# Altium schematic sheet LowerPlumbingBayBoardSchematic.SchDoc
size A3; SheetNumber: 1; SheetTotal: 1
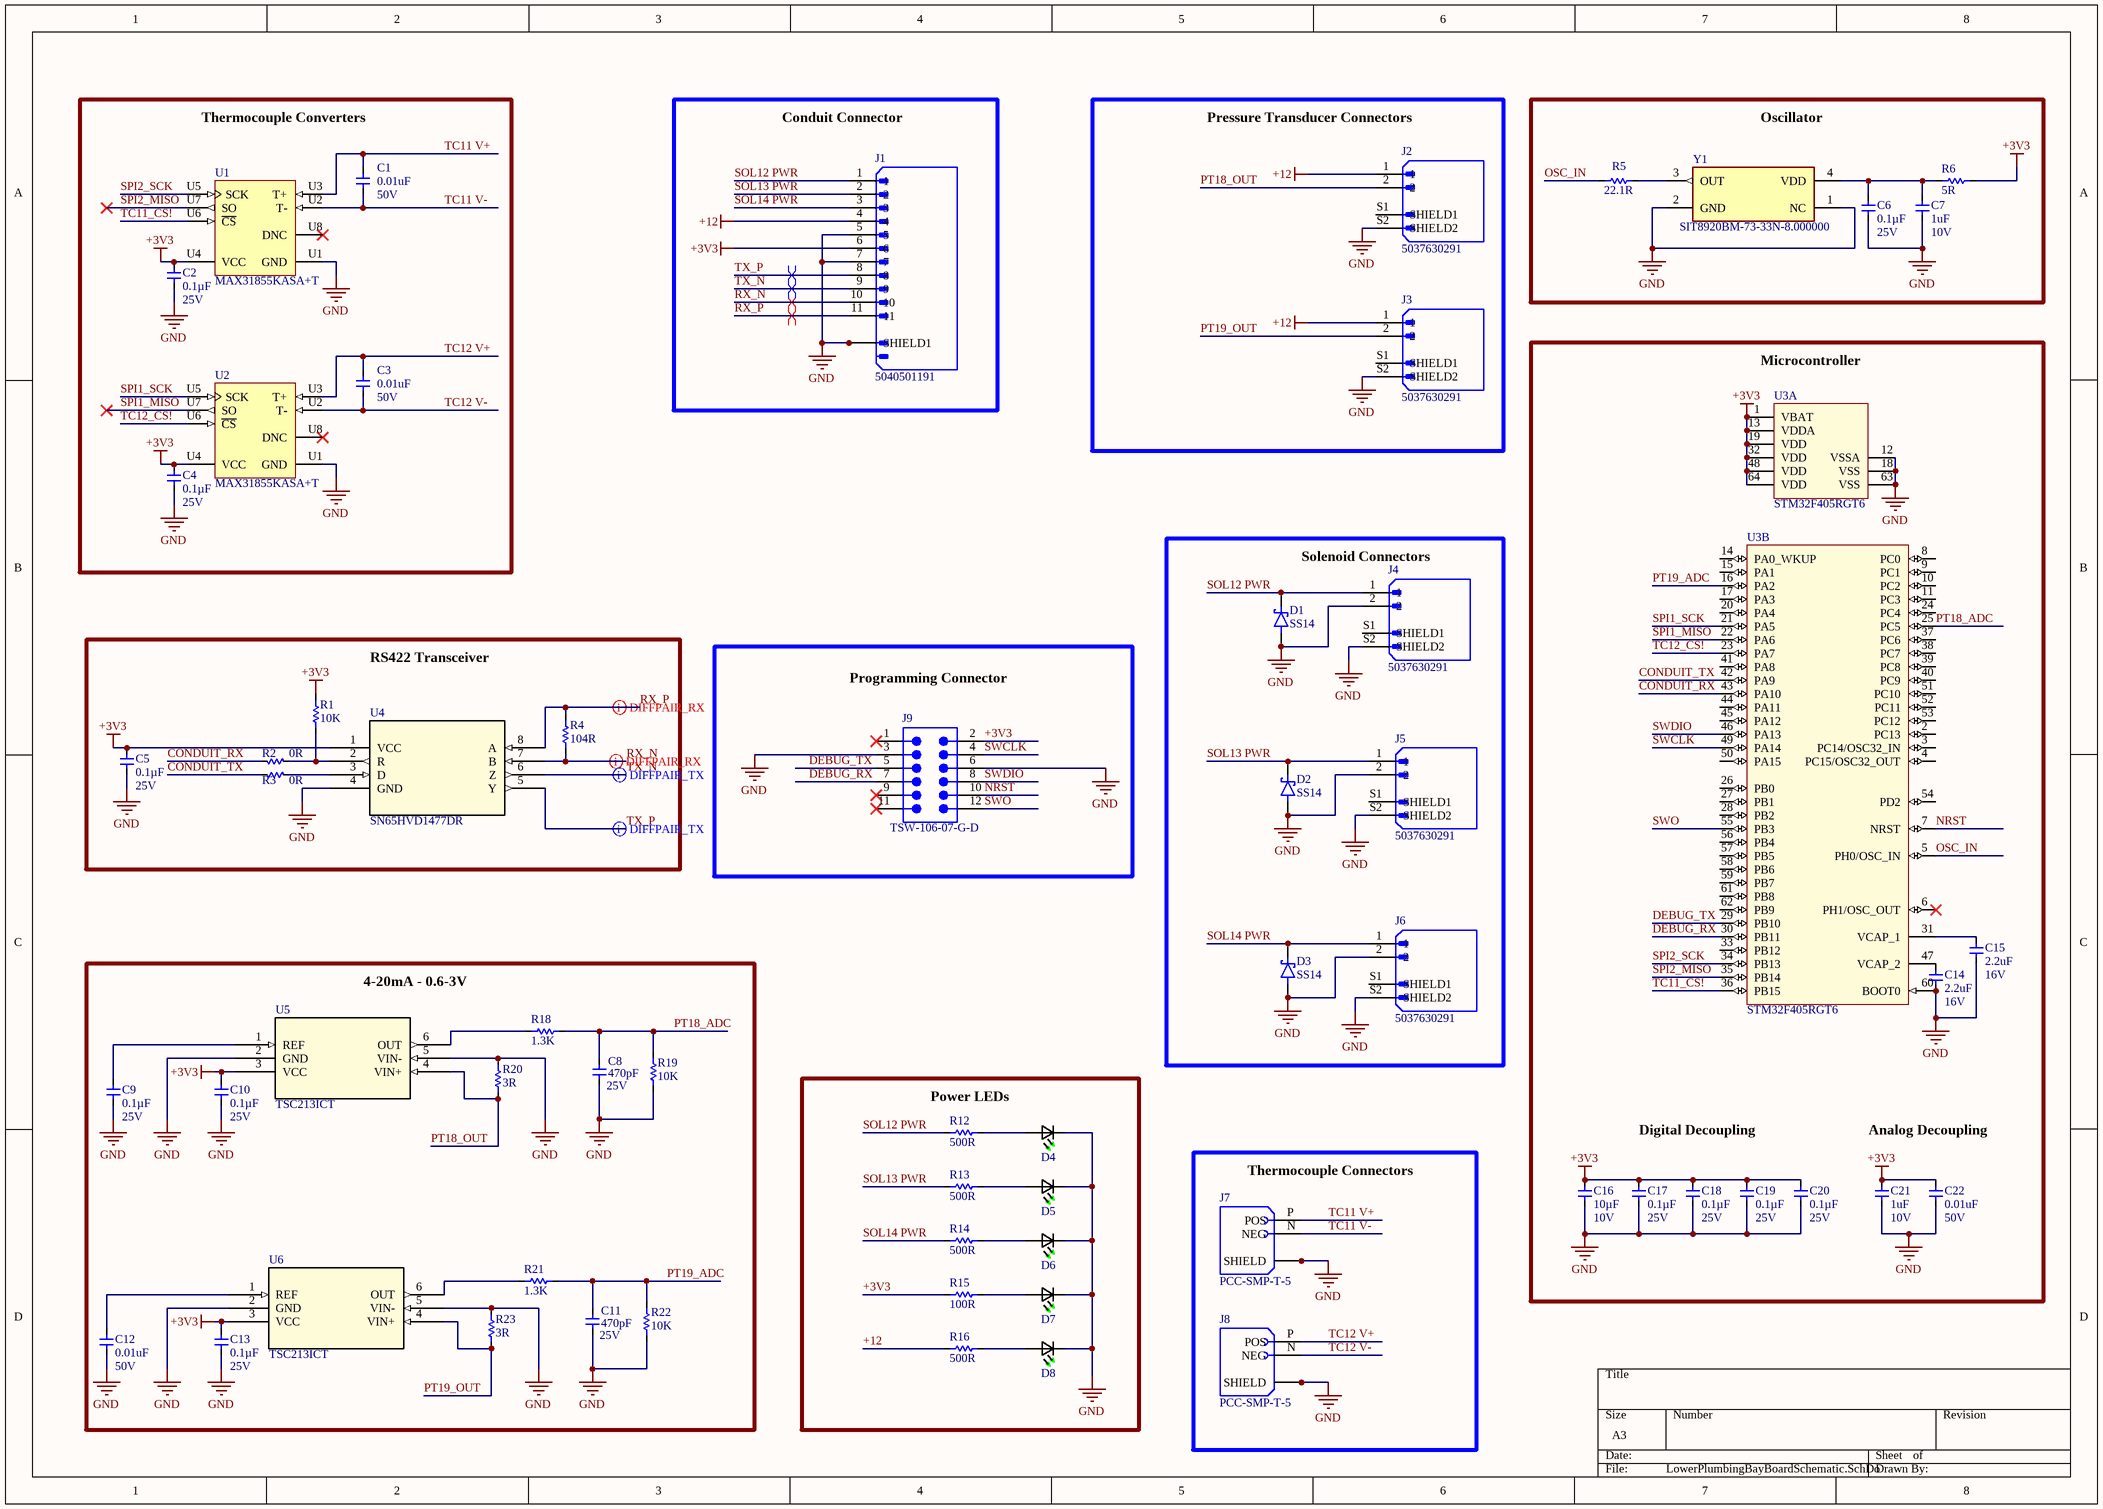
[diagram p0: LowerPlumbingBayBoardSchematic.SchDoc]

## Parts
C1  Capacitance: 0.01uF  Voltage - Rated: 50V  [0603]  (hidden comment: 06035A103JAT2A)
C2  Capacitance: 0.1µF  Voltage - Rated: 25V  [0603]  (hidden comment: CGA3E2X7R1E104K080AA)
C3  Capacitance: 0.01uF  Voltage - Rated: 50V  [0603]  (hidden comment: 06035A103JAT2A)
C4  Capacitance: 0.1µF  Voltage - Rated: 25V  [0603]  (hidden comment: CGA3E2X7R1E104K080AA)
C5  Capacitance: 0.1µF  Voltage - Rated: 25V  [0603]  (hidden comment: CGA3E2X7R1E104K080AA)
C6  Capacitance: 0.1µF  Voltage - Rated: 25V  [0603]  (hidden comment: CGA3E2X7R1E104K080AA)
C7  Capacitance: 1uF  Voltage - Rated: 10V  [0603]  (hidden comment: CL10A105KP8NNNC)
C8  Capacitance: 470pF  Voltage - Rated: 25V  [0603]  (hidden comment: 06031C471JAZ2A)
C9  Capacitance: 0.1µF  Voltage - Rated: 25V  [0603]  (hidden comment: 06035A103JAT2A)
C10  Capacitance: 0.1µF  Voltage - Rated: 25V  [0603]  (hidden comment: CGA3E2X7R1E104K080AA)
C11  Capacitance: 470pF  Voltage - Rated: 25V  [0603]  (hidden comment: 06031C471JAZ2A)
C12  Capacitance: 0.01uF  Voltage - Rated: 50V  [0603]  (hidden comment: 06035A103JAT2A)
C13  Capacitance: 0.1µF  Voltage - Rated: 25V  [0603]  (hidden comment: CGA3E2X7R1E104K080AA)
C14  Capacitance: 2.2uF  Voltage - Rated: 16V  [0603]  (hidden comment: C1608X5R1C225K080AB)
C15  Capacitance: 2.2uF  Voltage - Rated: 16V  [0603]  (hidden comment: C1608X5R1C225K080AB)
C16  Capacitance: 10µF  Voltage - Rated: 10V  [0603]  (hidden comment: CGA3EDX7T1A106M080AU)
C17  Capacitance: 0.1µF  Voltage - Rated: 25V  [0603]  (hidden comment: CGA3E2X7R1E104K080AA)
C18  Capacitance: 0.1µF  Voltage - Rated: 25V  [0603]  (hidden comment: CGA3E2X7R1E104K080AA)
C19  Capacitance: 0.1µF  Voltage - Rated: 25V  [0603]  (hidden comment: CGA3E2X7R1E104K080AA)
C20  Capacitance: 0.1µF  Voltage - Rated: 25V  [0603]  (hidden comment: CGA3E2X7R1E104K080AA)
C21  Capacitance: 1uF  Voltage - Rated: 10V  [0603]  (hidden comment: CL10A105KP8NNNC)
C22  Capacitance: 0.01uF  Voltage - Rated: 50V  [0603]  (hidden comment: 06035A103JAT2A)
D1  SS14  [DIOM4325X250N]
D2  SS14  [DIOM4325X250N]
D3  SS14  [DIOM4325X250N]
D4  LTST-C191KGKT  [LTST-C191KGKT]  (value not drawn)
D5  LTST-C191KGKT  [LTST-C191KGKT]  (value not drawn)
D6  LTST-C191KGKT  [LTST-C191KGKT]  (value not drawn)
D7  LTST-C191KGKT  [LTST-C191KGKT]  (value not drawn)
D8  LTST-C191KGKT  [LTST-C191KGKT]  (value not drawn)
J1  5040501191  [MOLEX_5040501191]
J2  5037630291  [2MOLEX_5037630291]
J3  5037630291  [2MOLEX_5037630291]
J4  5037630291  [2MOLEX_5037630291]
J5  5037630291  [2MOLEX_5037630291]
J6  5037630291  [2MOLEX_5037630291]
J7  PCC-SMP-T-5  [OMEGA_PCC-SMP-K-5]
J8  PCC-SMP-T-5  [OMEGA_PCC-SMP-K-5]
J9  TSW-106-07-G-D  [SMTC-TSW-106-07-X-D]
R1  Resistance: 10K  [0603]  (hidden comment: ERJ-3GEYJ103V)
R2  value 0R  [0603]  (hidden comment: RC0603JR-070RL)
R3  value 0R  [0603]  (hidden comment: RC0603JR-070RL)
R4  Resistance: 104R  [0603]  (hidden comment: RN73H1JTTD1040D25)
R5  Resistance: 22.1R  [0603]  (hidden comment: ERJ-P03F22R1V)
R6  Resistance: 5R  [BO_PWR2010]  (hidden comment: PWR2010W5R00JE)
R12  Resistance: 500R  [0603]  (hidden comment: RT0603BRC07500RL)
R13  Resistance: 500R  [0603]  (hidden comment: RT0603BRC07500RL)
R14  Resistance: 500R  [0603]  (hidden comment: RT0603BRC07500RL)
R15  Resistance: 100R  [0603]  (hidden comment: ERJ-P03F1000V)
R16  Resistance: 500R  [0603]  (hidden comment: RT0603BRC07500RL)
R18  Resistance: 1.3K  [0603]  (hidden comment: ERJ-H3EF1301V)
R19  Resistance: 10K  [0603]  (hidden comment: ERJ-3GEYJ103V)
R20  Resistance: 3R  [0603]  (hidden comment: ERJ-3RQF3R0V)
R21  Resistance: 1.3K  [0603]  (hidden comment: ERJ-H3EF1301V)
R22  Resistance: 10K  [0603]  (hidden comment: ERJ-3GEYJ103V)
R23  Resistance: 3R  [0603]  (hidden comment: ERJ-3RQF3R0V)
U1  MAX31855KASA+T  [MAXM-S8+4_L]
U2  MAX31855KASA+T  [MAXM-S8+4_L]
U3  STM32F405RGT6  [STM-LQFP64_L]  (parts A,B of 2)
U4  SN65HVD1477DR  [D8_TEX]
U5  TSC213ICT  [SC70-6_STM]
U6  TSC213ICT  [SC70-6_STM]
Y1  SIT8920BM-73-33N-8.000000  [FP-SIT8920BM-73-33N-8_000-MFG]

## Blocks framed on the sheet
Thermocouple Converters: C1-C4 U1 U2
Conduit Connector: J1
Pressure Transducer Connectors: J2 J3
Oscillator: C6 C7 R5 R6 Y1
Solenoid Connectors: D1-D3 J4-J6
RS422 Transceiver: C5 R1-R4 U4
Programming Connector: J9
4-20mA - 0.6-3V: C8-C13 R18-R23 U5 U6
Power LEDs: D4-D8 R12-R16
Thermocouple Connectors: J7 J8

## Nets
+3V3: C2.1 C4.1 C5.1 C10.1 C13.1 C16.1 C17.1 C18.1 C19.1 C20.1 C21.1 C22.1 J1.6 J9.2 R1.2 R6.2 R15.1 U1.U4(VCC) U2.U4(VCC) U3.1(VBAT) U3.13(VDDA) U3.19(VDD) U3.32(VDD) U3.48(VDD) U3.64(VDD) U4.1(VCC) U5.3(VCC) U6.3(VCC)
+12: J1.4 J2.1 J3.1 R16.1
GND: C2.2 C4.2 C5.2 C6.1 C7.1 C8.2 C9.2 C10.2 C11.2 C12.2 C13.2 C14.2 C15.1 C16.2 C17.2 C18.2 C19.2 C20.2 C21.2 C22.2 D1.A D2.A D3.A D4.1(K2) D5.1(K2) D6.1(K2) D7.1(K2) D8.1(K2) J1.5 J1.7 J1.S1(SHIELD1) J1.S2(SHIELD1) J2.S2(SHIELD2) J3.S2(SHIELD2) J4.2 J4.S2(SHIELD2) J5.2 J5.S2(SHIELD2) J6.2 J6.S2(SHIELD2) J7.S1(SHIELD) J7.S2(SHIELD) J8.S1(SHIELD) J8.S2(SHIELD) J9.3 J9.6 R19.1 R20.2 R22.1 R23.2 U1.U1(GND) U2.U1(GND) U3.12(VSSA) U3.18(VSS) U3.60(BOOT0) U3.63(VSS) U4.4(GND) U5.2(GND) U5.5(VIN-) U6.2(GND) U6.5(VIN-) Y1.1(NC) Y1.2(GND)
CONDUIT_RX: R2.1 U3.43(PA10)
CONDUIT_TX: R3.1 U3.42(PA9)
DEBUG_RX: J9.7 U3.30(PB11)
DEBUG_TX: J9.5 U3.29(PB10)
NRST: J9.10 U3.7(NRST)
OSC_IN: R5.1 U3.5(PH0/OSC_IN)
PT18_ADC: C8.1 R18.2 R19.2 U3.25(PC5)
PT18_OUT: J2.2 R20.1 U5.4(VIN+)
PT19_ADC: C11.1 R21.2 R22.2 U3.16(PA2)
PT19_OUT: J3.2 R23.1 U6.4(VIN+)
RX_N: J1.10 R4.1 U4.7(B)
RX_P: J1.11 R4.2 U4.8(A)
SOL12 PWR: D1.C(K) J1.1 J4.1 R12.1
SOL13 PWR: D2.C(K) J1.2 J5.1 R13.1
SOL14 PWR: D3.C(K) J1.3 J6.1 R14.1
SPI1_MISO: U2.U7(SO) U3.22(PA6)
SPI1_SCK: U2.U5(SCK) U3.21(PA5)
SPI2_MISO: U1.U7(SO) U3.35(PB14)
SPI2_SCK: U1.U5(SCK) U3.34(PB13)
SWCLK: J9.4 U3.49(PA14)
SWDIO: J9.8 U3.46(PA13)
SWO: J9.12 U3.55(PB3)
TC11 V+: C1.1 J7.P(POS) U1.U3(T+)
TC11 V-: C1.2 J7.N(NEG) U1.U2(T-)
TC11_CS!: U1.U6(~{CS}) U3.36(PB15)
TC12 V+: C3.1 J8.P(POS) U2.U3(T+)
TC12 V-: C3.2 J8.N(NEG) U2.U2(T-)
TC12_CS!: U2.U6(~{CS}) U3.23(PA7)
TX_N: J1.9 U4.6(Z)
TX_P: J1.8 U4.5(Y)
NetC6_2: C6.2 C7.2 R6.1 Y1.4(VDD)
NetC9_1: C9.1 U5.1(REF)
NetC12_1: C12.1 U6.1(REF)
NetC14_1: C14.1 U3.47(VCAP_2)
NetC15_2: C15.2 U3.31(VCAP_1)
NetD4_2: D4.2(A2) R12.2
NetD5_2: D5.2(A2) R13.2
NetD6_2: D6.2(A2) R14.2
NetD7_2: D7.2(A2) R15.2
NetD8_2: D8.2(A2) R16.2
NetR1_1: R1.1 R2.2 U4.2(R)
NetR3_2: R3.2 U4.3(D)
NetR5_2: R5.2 Y1.3(OUT)
NetR18_1: R18.1 U5.6(OUT)
NetR21_1: R21.1 U6.6(OUT)

Not connected (* = marked no-connect by the designer): J2 S1(SHIELD1); J3 S1(SHIELD1); J4 S1(SHIELD1); J5 S1(SHIELD1); J6 S1(SHIELD1); J9 1* 9* 11*; U1 U8(DNC)*; U2 U8(DNC)*; U3 2(PC13) 3(PC14/OSC32_IN) 4(PC15/OSC32_OUT) 6(PH1/OSC_OUT)* 8(PC0) 9(PC1) 10(PC2) 11(PC3) 14(PA0_WKUP) 15(PA1) 17(PA3) 20(PA4) 24(PC4) 26(PB0) 27(PB1) 28(PB2) 33(PB12) 37(PC6) 38(PC7) 39(PC8) 40(PC9) 41(PA8) 44(PA11) 45(PA12) 50(PA15) 51(PC10) 52(PC11) 53(PC12) 54(PD2) 56(PB4) 57(PB5) 58(PB6) 59(PB7) 61(PB8) 62(PB9)

## Layout directives
differential pair: RX_N, RX_P, TX_N, TX_P

## Notes on the sheet
- (near U3) Microcontroller
- Digital Decoupling
- Analog Decoupling

## Library data of the parts
C1 C3 C22 = CGA3E2X7R1H103K080AA: Multilayer Ceramic Capacitors MLCC - SMD/SMT .01UF 50V 5% 0603; Manufacturer: TDK Corporation; Tolerance: ±10%; Temperature Coefficient: X7R; Operating Temperature: -55°C ~ 125°C; Mounting Type: Surface Mount, MLCC; Package / Case: 0603 (1608 Metric); Size / Dimension: 0.063" L x 0.031" W (1.60mm x 0.80mm); Manufacturer Part Number: CGA3E2X7R1H103K080AA; Thickness (Max): 0.035" (0.90mm)
  C3 C22: ComponentLink1Description: Datasheet; ComponentLink1URL: https://product.tdk.com/info/en/catalog/spec/mlccspec_automotive_general_en.pdf; Supplier 1: Digi-Key; Supplier Part Number 1: 445-5662-1-ND
C2 C4-C6 C10 C13 C17-C20 = CGA3E2X7R1E104K080AA: CAP CER 0.1UF 25V X7R 0603; Manufacturer: TDK Corporation; Tolerance: ±10%; Temperature Coefficient: X7R; Operating Temperature: -55°C ~ 125°C; Mounting Type: Surface Mount, MLCC; Package / Case: 0603 (1608 Metric); Size / Dimension: 0.063" L x 0.031" W (1.60mm x 0.80mm); Manufacturer Part Number: CGA3E2X7R1E104K080AA; Thickness (Max): 0.035" (0.90mm); ComponentLink1Description: Datasheet; ComponentLink1URL: https://product.tdk.com/info/en/catalog/spec/mlccspec_automotive_general_en.pdf; Supplier 1: Digi-Key; Supplier Part Number 1: 445-5667-1-ND
C7 C21 = CL10A105KP8NNNC: CAP CER 1UF 10V X5R 0603; Manufacturer: Samsung Electro-Mechanics; Tolerance: ±10%; Temperature Coefficient: X5R; Operating Temperature: -55°C ~ 85°C; Mounting Type: Surface Mount, MLCC; Package / Case: 0603 (1608 Metric); Size / Dimension: 0.063" L x 0.031" W (1.60mm x 0.80mm); Manufacturer Part Number: CL10A105KP8NNNC; Thickness (Max): 0.035" (0.90mm); ComponentLink1Description: Datasheet; ComponentLink1URL: http://www.samsungsem.com/kr/support/product-search/mlcc/__icsFiles/afieldfile/2019/05/10/19-CL10A105KP8NNNC.pdf; Supplier 1: Digi-Key; Supplier Part Number 1: 1276-1182-1-ND
C8 C11 = CGA3E2X7R1E104K080AA: Multilayer Ceramic Capacitors MLCC - SMD/SMT 100V 470pF X7R 0603 5% Flex Soft; Manufacturer: TDK Corporation; Tolerance: ±10%; Temperature Coefficient: X7R; Operating Temperature: -55°C ~ 125°C; Mounting Type: Surface Mount, MLCC; Package / Case: 0603 (1608 Metric); Size / Dimension: 0.063" L x 0.031" W (1.60mm x 0.80mm); Manufacturer Part Number: CGA3E2X7R1E104K080AA; Thickness (Max): 0.035" (0.90mm); ComponentLink1Description: Datasheet; ComponentLink1URL: https://product.tdk.com/info/en/catalog/spec/mlccspec_automotive_general_en.pdf; Supplier 1: Digi-Key; Supplier Part Number 1: 445-5667-1-ND
C9 C12 = CGA3E2X7R1E104K080AA: Multilayer Ceramic Capacitors MLCC - SMD/SMT .01UF 50V 5% 0603; Manufacturer: TDK Corporation; Tolerance: ±10%; Temperature Coefficient: X7R; Operating Temperature: -55°C ~ 125°C; Mounting Type: Surface Mount, MLCC; Package / Case: 0603 (1608 Metric); Size / Dimension: 0.063" L x 0.031" W (1.60mm x 0.80mm); Manufacturer Part Number: CGA3E2X7R1E104K080AA; Thickness (Max): 0.035" (0.90mm); ComponentLink1Description: Datasheet; ComponentLink1URL: https://product.tdk.com/info/en/catalog/spec/mlccspec_automotive_general_en.pdf; Supplier 1: Digi-Key; Supplier Part Number 1: 445-5667-1-ND
C14 C15 = C1608X5R1C225K080AB: CAP CER 2.2UF 16V X5R 0603; Manufacturer: TDK Corporation; Tolerance: ±10%; Temperature Coefficient: X5R; Operating Temperature: -55°C ~ 85°C; Mounting Type: Surface Mount, MLCC; Package / Case: 0603 (1608 Metric); Size / Dimension: 0.063" L x 0.031" W (1.60mm x 0.80mm); Manufacturer Part Number: C1608X5R1C225K080AB; Thickness (Max): 0.035" (0.90mm); ComponentLink1Description: Datasheet; ComponentLink1URL: https://product.tdk.com/info/en/catalog/spec/mlccspec_commercial_general_midvoltage_en.pdf; Supplier 1: Digi-Key; Supplier Part Number 1: 445-5157-1-ND
C16 = CL10A106MP8NNNC: Multilayer Ceramic Capacitors MLCC - SMD/SMT 0603,X7T,10V,10uF,+/-20%,0.8mm, AEC-Q200; Manufacturer: Samsung Electro-Mechanics; Tolerance: ±20%; Temperature Coefficient: X5R; Operating Temperature: -55°C ~ 85°C; Mounting Type: Surface Mount, MLCC; Package / Case: 0603 (1608 Metric); Size / Dimension: 0.063" L x 0.031" W (1.60mm x 0.80mm); Manufacturer Part Number: CL10A106MP8NNNC; Thickness (Max): 0.035" (0.90mm); ComponentLink1Description: Datasheet; ComponentLink1URL: https://static6.arrow.com/aropdfconversion/f91a1722e2705c3d73cfb1979021b64ae4055093/19-cl10a106mp8nnnc.pdf; Supplier 1: Digi-Key; Supplier Part Number 1: 1276-1871-1-ND
D1-D3 = SS14: Schottky Diodes & Rectifiers SMA 40V 1.0A; Value: *; Availability: Unavailable; Price: None; Package: None; MP: SS14
D4-D8 = LTST-C191KGKT: LED,  LTST-C191KGKT; Manufacturer: Vishay Lite-On; Color: Green; Lens Color: Colorless; Luminous Intensity: 35mcd; Viewing Angle: 130°; Forward Voltage: 2V; Dominant Wavelength: 571nm; Test Current: 20mA; Lens Transparency: Clear; Wavelength: 574nm; Lens Style: Flat,Rectangular,Colorless; Number of LEDs: 1; Max Power Dissipation: 75mW; Lens Size: 0.8mm; Supplier 1: Arrow Electronics; Supplier Part Number 1: LTST-C191KGKT; Manufacturer Part Number: LTST-C191KGKT; RoHS: Yes; Category: Uncategorized; Stock: 3111; Pricing: 1=0.223, 10=0.1424, 25=0.1365, 100=0.0663, 250=0.0656, 500=0.0612, 1000=0.0451, 2000=0.0464, 3000=0.0448, 5000=0.0403, 10000=0.0363, 25000=0.0323, 50000=0.0316 (USD); Mount: Surface Mount; Case/Package: 0603; Number of Pins: 2; Case Code (Metric): 1608; Case Code (Imperial): 0603; Min Operating Temperature: -55°C; Max Operating Temperature: 85°C; Packaging: Tape and Reel; Series: -; Length: 1.6mm; Width: 0.8mm; Height: 0.65mm; RoHS Compliant: Yes; Lead Free: Lead Free; ComponentLink1URL: https://datasheet.ciiva.com/2109/ltst-c191kgkt-2109973.pdf?src-supplier=Digi-Key; ComponentLink1Description: https://datasheet.ciiva.com/2109/ltst-c191kgkt-2109973.pdf?src-supplier=Digi-Key
J1 = 5040501191: Headers & Wire Housings 1.5MM PicoLock SMT HDR RA POS SDLCK 11P; Price: None; Availability: Unavailable; MP: 5040501191; Value: *; Package: None
J2-J6 = 5037630291: Headers & Wire Housings PicoLock 1.0 WB Plg R/A 2Ckt Pos SideLk; Value: *; Package: None; Price: None; Availability: Unavailable; MP: 5037630291
J7 J8 = PCC-SMP-K-5: Thermocouple Connector, Circuit Board, Socket, Type T, Miniature, PCC SMP Series; MF: Omega Engineering; MP: PCC-SMP-K-5; Check_prices: https://www.snapeda.com/parts/PCC-SMP-K-5/Omega%20Engineering/view-part/2886965/?ref=eda; Package: None; SnapEDA_Link: https://www.snapeda.com/parts/PCC-SMP-K-5/Omega%20Engineering/view-part/2886965/?ref=snap; Value: *; Price: None; Availability: No availability data
J9 = SMTC-TSW-106-07-X-D_1: 0.025" SQ Post Header, Through-hole, Vertical, -55 to 125 degC, 2.54 mm Pitch, 12-Pin, Male, RoHS; Manufacturer: Samtec; Pitch: 2.54 mm; ComponentLink1URL: http://www.samtec.com; DatasheetVersion: F-214; ComponentLink3URL: http://www.samtec.com/documents/webfiles/cpdf/TSW-XXX-XX-XXX-X-XX-XXX-MKT.pdf; PackageVersion: DM, 8/1988; Mounting Technology: Through-hole; ComponentLink1Description: Manufacturer URL; Orientation: Vertical; PackageDescription: .025[0.64] SQ. Post Terminal Strip Assembly; ComponentLink2URL: http://www.samtec.com/documents/webfiles/pdf/TSW_TH.PDF; RoHS: True; ComponentLink3Description: Package Specification; ComponentLink2Description: Datasheet; PackageReference: TSW-106-07-X-D; Temperature Range: -55 to 125 degC; PartNumber: TSW-106-07-G-D
R1 R19 R22 = ERJ-3GEYJ103V: SMD Chip Resistor, 10 kOhm, ï¿½ 5%, 100 mW, 0603 [1608 Metric], Thick Film, General Purpose; Manufacturer: Panasonic Electronic Components; Power  (W): 0.1W; Temperature Coefficient: ±200ppm/°C; Package: 0603 (1608 Metric); Tolerance: ±5%; Operating Temperature: -55°C ~ 155°C; Composition: Thick Film; Manufacturer Part Number: ERJ-3GEYJ103V; ComponentLink1Description: Datasheet; ComponentLink1URL: https://industrial.panasonic.com/cdbs/www-data/pdf/RDA0000/DMA0000COL11.pdf; Supplier 1: Digi-Key; Supplier Part Number 1: P10KGCT-ND; ComponentLink2Description: Land Pattern; ComponentLink2URL: https://industrial.panasonic.com/cdbs/www-data/pdf/RDA0000/DMA0000COL17.pdf
R2 R3 = RT-0R00-F-1/10W-0603: RES SMD 0 OHM 1% JUMPER 1/10W 0603; Manufacturer: Stackpole Electronics Inc; Manufacturer Part #: RMCF0603ZT0R00; Part Description: 0 Ohms Jumper 0.1W, 1/10W Chip Resistor 0603 (1608 Metric) Automotive AEC-Q200 Thick Film; ComponentLink1description: Datasheet; ComponentLink1URL: https://industrial.panasonic.com/ww/products/resistors/chip-resistors/general-purpose-chip-resistors/models/ERJ2GE0R00X; ComponentLink2description: Manufacturer Website; Distributor: Digikey; Distributor Part #: RMCF0603ZT0R00CT-ND; ComponentLink2URL: https://industrial.panasonic.com/ww/products/resistors/chip-resistors/general-purpose-chip-resistors/models/ERJ2GE0R00X
  R2: Supplier 1: Future Electronics; Supplier Part Number 1: 3992146
R4 = ERJ-3GEYJ103V: Thin Film Resistors - SMD 104Ohm,0603,0.5%,25p; Manufacturer: Panasonic Electronic Components; Power  (W): 0.1W; Tolerance: ±5%; Temperature Coefficient: ±200ppm/°C; Package: 0603 (1608 Metric); Operating Temperature: -55°C ~ 155°C; Composition: Thick Film; Manufacturer Part Number: ERJ-3GEYJ103V; ComponentLink1Description: Datasheet; ComponentLink1URL: https://industrial.panasonic.com/cdbs/www-data/pdf/RDA0000/DMA0000COL11.pdf; Supplier 1: Digi-Key; Supplier Part Number 1: P10KGCT-ND; ComponentLink2Description: Land Pattern; ComponentLink2URL: https://industrial.panasonic.com/cdbs/www-data/pdf/RDA0000/DMA0000COL17.pdf
R5 = ERJ-3EKF38R3V: Thick Film Resistors - SMD 0603 22.1ohms 0.2W 1% AEC-Q200; Manufacturer: Panasonic; Power Rating: 100mW; Voltage Rating: 75V; Temperature Coefficient: 100ppm/°C; Voltage Rating (DC): 50V; Supplier 1: Newark; Supplier Part Number 1: 01AC1806; Manufacturer Part Number: ERJ-3EKF38R3V; RoHS: Yes; Category: Chip SMD Resistors; Stock: 83770; Pricing: 10=0.04200, 25=0.03500, 50=0.02700, 100=0.01800 (CAD); Mount: Surface Mount; Case/Package: 0603; Case Code (Metric): 1608; Case Code (Imperial): 0603; Weight: 7.1E-05oz; Contact Plating: Tin; Min Operating Temperature: -55°C; Max Operating Temperature: 155°C; Packaging: Tape and Reel; Tolerance: 1%; Package Quantity: 1; Resistor Type: Thick Film; Number of Terminations: 2; Termination: SMD/SMT; Max Power Dissipation: 100mW; Features: Automotive AEC-Q200; Series: ERJ; Construction: Rectangular; Resistance Tolerance: 1%; Length: 0.063inch; Width: 0.8mm; Height: 0.022inch; Depth: 0.8mm; Reach SVHC Compliant: Yes; Military Standard: Not; Lead Free: Lead Free; RoHS Compliant: Yes; ComponentLink1URL: https://datasheet.ciiva.com/22760/1678782-22760701.pdf?src-supplier=Farnell; ComponentLink1Description: https://datasheet.ciiva.com/22760/1678782-22760701.pdf?src-supplier=Farnell; ComponentLink2URL: https://datasheet.ciiva.com/22741/1678782-22741961.pdf?src-supplier=Element14; ComponentLink2Description: https://datasheet.ciiva.com/22741/1678782-22741961.pdf?src-supplier=Element14; ComponentLink3URL: https://datasheet.ciiva.com/24165/aoa0000ce2-24165276.pdf?src-supplier=Mouser; ComponentLink3Description: https://datasheet.ciiva.com/24165/aoa0000ce2-24165276.pdf?src-supplier=Mouser
R6 = PWR2010W5R00JE: Res Wirewound 2010 5 Ohm 5% 1/2W ±50ppm/°C Molded SMD SMD T/R; Manufacturer: Bourns; Power Rating: 500mW; Threshold Voltage: 1.6V; Supplier 1: Newark; Supplier Part Number 1: 05R8093; Manufacturer Part Number: PWR2010W5R00JE; RoHS: Yes; Category: Chip SMD Resistors; Stock: 26; Pricing: 1=0.68700, 10=0.68700, 25=0.68700, 50=0.68700, 100=0.68700, 250=0.68700 (CAD); Mount: Surface Mount; Case/Package: 2010; Number of Pins: 2; Case Code (Metric): 5025; Case Code (Imperial): 2010; Min Operating Temperature: -55°C; Max Operating Temperature: 155°C; Tolerance: 5%; Resistor Type: Wirewound; Temperature Coefficient: 50ppm/°C; Packaging: Cut Tape; Package Quantity: 1; Number of Terminations: 2; Termination: Solder; Max Power Dissipation: 500mW; Series: PWR2010; Resistance Tolerance: 5%; Technology: WIRE WOUND; Length: 0.2inch; Width: 0.1inch; Height: 0.148inch; Depth: 2.54mm; Reach SVHC Compliant: Yes; Military Standard: Not; ComponentLink1URL: https://datasheet.ciiva.com/7986/1727932-7986277.pdf?src-supplier=Element14; ComponentLink1Description: https://datasheet.ciiva.com/7986/1727932-7986277.pdf?src-supplier=Element14; ComponentLink2URL: https://datasheet.ciiva.com/22713/1727932-22713400.pdf?src-supplier=Element14; ComponentLink2Description: https://datasheet.ciiva.com/22713/1727932-22713400.pdf?src-supplier=Element14; ComponentLink3URL: https://datasheet.ciiva.com/9122/pwr2010-9122735.pdf?src-supplier=Avnet; ComponentLink3Description: https://datasheet.ciiva.com/9122/pwr2010-9122735.pdf?src-supplier=Avnet; ComponentLink4URL: https://datasheet.ciiva.com/15865/pwr2010-15865624.pdf?src-supplier=Onlinecomponents.com; ComponentLink4Description: https://datasheet.ciiva.com/15865/pwr2010-15865624.pdf?src-supplier=Onlinecomponents.com; ComponentLink5URL: https://datasheet.ciiva.com/2484/pwr2010-2484257.pdf?src-supplier=Digi-Key; ComponentLink5Description: https://datasheet.ciiva.com/2484/pwr2010-2484257.pdf?src-supplier=Digi-Key; ComponentLink6URL: https://datasheet.ciiva.com/2484/pwr2010-2484258.pdf?src-supplier=Digi-Key; ComponentLink6Description: https://datasheet.ciiva.com/2484/pwr2010-2484258.pdf?src-supplier=Digi-Key; ComponentLink7URL: https://datasheet.ciiva.com/2484/pwr2010-2484256.pdf?src-supplier=Digi-Key; ComponentLink7Description: https://datasheet.ciiva.com/2484/pwr2010-2484256.pdf?src-supplier=Digi-Key
R12-R14 R16 = RC0603FR-071KL: Thin Film Resistors - SMD 500 ohm 0.1% 15ppm H igh Stability; Manufacturer: Yageo; Tolerance: 1%; Temperature Coefficient: 100ppm/°C; Power Rating: 100mW; Voltage Rating: 50V; Supplier 1: Future Electronics; Supplier Part Number 1: 4016291; Manufacturer Part Number: RC0603FR-071KL; RoHS: Yes; Category: Chip SMD Resistors; Stock: 11600000; Pricing: 5000=0.0015, 50000=0.0014, 200000=0.0014, 625000=0.0013, 2000000=0.0012 (USD); Case/Package: 0603; Contact Plating: Tin,Matte; Case Code (Imperial): 0603; Case Code (Metric): 1608; Size Code: 0603; Min Operating Temperature: -55°C; Max Operating Temperature: 155°C; Resistor Type: Thick Film; Packaging: Tape and Reel; Termination: SMD/SMT; Features: Moisture Resistant; Series: RC; Max Power Dissipation: 100mW; Number of Terminations: 2; Technology: THICK FILM; Resistance Tolerance: 1%; Construction: Rectangular; Length: 1.6mm; Height: 0.45mm; Depth: 0.8mm; Reach SVHC Compliant: No; Military Standard: Not; Lead Free: Lead Free; RoHS Compliant: Yes; ComponentLink1URL: https://datasheet.ciiva.com/11808/0900766b80f96399-11808081.pdf?src-supplier=Rs; ComponentLink1Description: https://datasheet.ciiva.com/11808/0900766b80f96399-11808081.pdf?src-supplier=Rs; ComponentLink2URL: https://datasheet.ciiva.com/7746/1686128-7746280.pdf?src-supplier=Element14; ComponentLink2Description: https://datasheet.ciiva.com/7746/1686128-7746280.pdf?src-supplier=Element14; ComponentLink3URL: https://datasheet.ciiva.com/7660/1868787-7660790.pdf?src-supplier=Element14; ComponentLink3Description: https://datasheet.ciiva.com/7660/1868787-7660790.pdf?src-supplier=Element14; ComponentLink4URL: https://datasheet.ciiva.com/7983/443971-7983613.pdf?src-supplier=Element14; ComponentLink4Description: https://datasheet.ciiva.com/7983/443971-7983613.pdf?src-supplier=Element14; ComponentLink5URL: https://datasheet.ciiva.com/7746/1738695-7746281.pdf?src-supplier=Element14; ComponentLink5Description: https://datasheet.ciiva.com/7746/1738695-7746281.pdf?src-supplier=Element14; ComponentLink6URL: https://datasheet.ciiva.com/7746/1738695-7746279.pdf?src-supplier=Element14; ComponentLink6Description: https://datasheet.ciiva.com/7746/1738695-7746279.pdf?src-supplier=Element14; ComponentLink7URL: https://datasheet.ciiva.com/8896/pyu-rc0603-51-rohs-l-4-8896106.pdf?src-supplier=Avnet; ComponentLink7Description: https://datasheet.ciiva.com/8896/pyu-rc0603-51-rohs-l-4-8896106.pdf?src-supplier=Avnet; ComponentLink8URL: https://datasheet.ciiva.com/15189/getdatasheetpartid-404327-15189644.pdf?src-supplier=Verical; ComponentLink8Description: https://datasheet.ciiva.com/15189/getdatasheetpartid-404327-15189644.pdf?src-supplier=Verical
R15 = CRGCQ0402J330R: Thick Film Resistors - SMD 0603 100ohms 0.2W 1% AEC-Q200; Manufacturer: TE Connectivity; Tolerance: 5%; Max Power Dissipation: 63mW; Temperature Coefficient: 100ppm/°C; Supplier 1: Arrow Electronics; Supplier Part Number 1: CRGCQ0402J330R; Manufacturer Part Number: CRGCQ0402J330R; RoHS: Yes; Category: Chip SMD Resistors; Stock: 20410; Pricing: 1=0.0576, 10=0.0086, 100=0.0034, 250=0.0033, 500=0.0032, 1000=0.0018, 3000=0.0017, 6000=0.0016, 15000=0.0015 (USD); Case/Package: 0402; Case Code (Imperial): 0402; Case Code (Metric): 1005; Min Operating Temperature: -55°C; Max Operating Temperature: 155°C; Features: Moisture Resistant,Automotive AEC-Q200; Packaging: Cut Tape; Number of Terminations: 2; Series: CRGCQ; Ratings: AEC-Q200; RoHS Compliant: Yes; ComponentLink1URL: https://4donline.ihs.com/images/VipMasterIC/IC/TYEL/TYEL-S-A0004929575/TYEL-S-A0004929575-1.pdf?hkey=52A5661711E402568146F3353EA87419&src-supplier=Newark; ComponentLink1Description: https://4donline.ihs.com/images/VipMasterIC/IC/TYEL/TYEL-S-A0004929575/TYEL-S-A0004929575-1.pdf?hkey=52A5661711E402568146F3353EA87419&src-supplier=Newark; ComponentLink2URL: https://www.te.com/commerce/DocumentDelivery/DDEController?Action=srchrtrv&amp;DocNm=1773204-3&amp;DocType=DS&amp;DocLang=English&src-supplier=Digi-Key; ComponentLink2Description: https://www.te.com/commerce/DocumentDelivery/DDEController?Action=srchrtrv&amp;DocNm=1773204-3&amp;DocType=DS&amp;DocLang=English&src-supplier=Digi-Key; ComponentLink3URL: https://4donline.ihs.com/images/VipMasterIC/IC/TYEL/TYEL-S-A0004929575/TYEL-S-A0004929575-1.pdf?hkey=52A5661711E402568146F3353EA87419&src-supplier=Farnell; ComponentLink3Description: https://4donline.ihs.com/images/VipMasterIC/IC/TYEL/TYEL-S-A0004929575/TYEL-S-A0004929575-1.pdf?hkey=52A5661711E402568146F3353EA87419&src-supplier=Farnell
R18 R21 = PWR2010W5R00JE: Thick Film Resistors - SMD 0603 1.3KOhm 1% AEC-Q200; Manufacturer: Bourns; Tolerance: 5%; Temperature Coefficient: 50ppm/°C; Power Rating: 500mW; Threshold Voltage: 1.6V; Supplier 1: Newark; Supplier Part Number 1: 05R8093; Manufacturer Part Number: PWR2010W5R00JE; RoHS: Yes; Category: Chip SMD Resistors; Stock: 26; Pricing: 1=0.68700, 10=0.68700, 25=0.68700, 50=0.68700, 100=0.68700, 250=0.68700 (CAD); Mount: Surface Mount; Case/Package: 2010; Number of Pins: 2; Case Code (Metric): 5025; Case Code (Imperial): 2010; Min Operating Temperature: -55°C; Max Operating Temperature: 155°C; Resistor Type: Wirewound; Packaging: Cut Tape; Package Quantity: 1; Number of Terminations: 2; Termination: Solder; Max Power Dissipation: 500mW; Series: PWR2010; Resistance Tolerance: 5%; Technology: WIRE WOUND; Length: 0.2inch; Width: 0.1inch; Height: 0.148inch; Depth: 2.54mm; Reach SVHC Compliant: Yes; Military Standard: Not; ComponentLink1URL: https://datasheet.ciiva.com/7986/1727932-7986277.pdf?src-supplier=Element14; ComponentLink1Description: https://datasheet.ciiva.com/7986/1727932-7986277.pdf?src-supplier=Element14; ComponentLink2URL: https://datasheet.ciiva.com/22713/1727932-22713400.pdf?src-supplier=Element14; ComponentLink2Description: https://datasheet.ciiva.com/22713/1727932-22713400.pdf?src-supplier=Element14; ComponentLink3URL: https://datasheet.ciiva.com/9122/pwr2010-9122735.pdf?src-supplier=Avnet; ComponentLink3Description: https://datasheet.ciiva.com/9122/pwr2010-9122735.pdf?src-supplier=Avnet; ComponentLink4URL: https://datasheet.ciiva.com/15865/pwr2010-15865624.pdf?src-supplier=Onlinecomponents.com; ComponentLink4Description: https://datasheet.ciiva.com/15865/pwr2010-15865624.pdf?src-supplier=Onlinecomponents.com; ComponentLink5URL: https://datasheet.ciiva.com/2484/pwr2010-2484257.pdf?src-supplier=Digi-Key; ComponentLink5Description: https://datasheet.ciiva.com/2484/pwr2010-2484257.pdf?src-supplier=Digi-Key; ComponentLink6URL: https://datasheet.ciiva.com/2484/pwr2010-2484258.pdf?src-supplier=Digi-Key; ComponentLink6Description: https://datasheet.ciiva.com/2484/pwr2010-2484258.pdf?src-supplier=Digi-Key; ComponentLink7URL: https://datasheet.ciiva.com/2484/pwr2010-2484256.pdf?src-supplier=Digi-Key; ComponentLink7Description: https://datasheet.ciiva.com/2484/pwr2010-2484256.pdf?src-supplier=Digi-Key
R20 R23 = ERJ-3GEYJ103V: Current Sense Resistors - SMD 0603 3.0ohm 1% Curr Sense AEC-Q200; Manufacturer: Panasonic Electronic Components; Power  (W): 0.1W; Tolerance: ±5%; Temperature Coefficient: ±200ppm/°C; Package: 0603 (1608 Metric); Operating Temperature: -55°C ~ 155°C; Composition: Thick Film; Manufacturer Part Number: ERJ-3GEYJ103V; ComponentLink1Description: Datasheet; ComponentLink1URL: https://industrial.panasonic.com/cdbs/www-data/pdf/RDA0000/DMA0000COL11.pdf; Supplier 1: Digi-Key; Supplier Part Number 1: P10KGCT-ND; ComponentLink2Description: Land Pattern; ComponentLink2URL: https://industrial.panasonic.com/cdbs/www-data/pdf/RDA0000/DMA0000COL17.pdf
U1 U2 = MAX31855-S8+4_1: Cold Junction Compensated Thermocouple to Digital Converter, 14 Bits Temperature Resolution, -40 to 125 degC, 8-Pin SOIC (S8+4), Pb-Free, Tape ang Reel; Interface: SPI; Parasite Pwr.: No; Functions: Thermocouple-to-Digital Converter; ComponentLink3Description: Package Specification; DatasheetVersion: Rev. 2; Generic Part Number: MAX31855; PartNumber: MAX31855KASA+T; PackageReference: S8+4; ComponentLink3URL: http://pdfserv.maximintegrated.com/package_dwgs/21-0041.PDF; Code_JEDEC: MS-012; Packing: Tape ang Reel; PackageDescription: 8-Pin Small-Outline IC, Narrow, Body 3.9 x 4.9 mm, Pitch 1.27 mm; Mounting Technology: Surface Mount; ComponentLink1URL: http://www.maximintegrated.com/; PackageVersion: Rev. D, 10/2012; ComponentLink2URL: http://datasheets.maximintegrated.com/en/ds/MAX31855.pdf; ComponentLink1Description: Manufacturer URL; ComponentLink2Description: Datasheet; Supplier 1: Mouser; Supplier Part Number 1: 700-MAX31855KASA+T
U3 = STM32F405RGT6: IC MCU 32BIT 1MB FLASH 64LQFP; Manufacturer: STMicroelectronics; Core Processor: ARM® Cortex®-M4; Core Size: 32-Bit; Speed: 168MHz; Connectivity: CANbus, I²C, IrDA, LINbus, SPI, UART/USART, USB OTG; Peripherals: Brown-out Detect/Reset, DMA, I²S, LCD, POR, PWM, WDT; Number of I/O: 51; Program Memory Size: 1MB (1M x 8); RAM Size: 192K x 8; Voltage - Supply (VDD): 1.8V ~ 3.6V; Data Converters: A/D 16x12b; D/A 2x12b; Oscillator Type: Internal; ComponentLink1Description: Datasheet; ComponentLink1URL: https://www.st.com/content/ccc/resource/technical/document/datasheet/ef/92/76/6d/bb/c2/4f/f7/DM00037051.pdf/files/DM00037051.pdf/jcr:content/translations/en.DM00037051.pdf; Program Memory Type: FLASH; Manufacturer Part Number: STM32F405RGT6; Operating Temperature: -40°C ~ 85°C (TA); Mounting Type: Surface Mount; Package / Case: 64-LQFP; Supplier 1: Digi-Key; Supplier Part Number 1: 497-11767-ND
U4 = SN65HVD1477DR: 3.3V, Full-Duplex RS-485, 16kV IEC ESD, 50Mbps data rate, No Enables 8-SOIC -40 to 125; Mfr_Name: Texas Instruments; Copyright: Copyright (C) 2022 Ultra Librarian. All rights reserved.; Manufacturer_Part_Number: SN65HVD1477DR; RefDes: RefDes; Type: DEV
U5 U6 = TSC213ICT: No Description Available; Mfr_Name: STMicroelectronics; RefDes: RefDes; Type: Type
Y1 = CMP-25149-000010-1: MEMS OSC XO 8.0000MHZ LVCM LVTTL